# Altium project MB1272.PrjPcb (part 1 of 5)
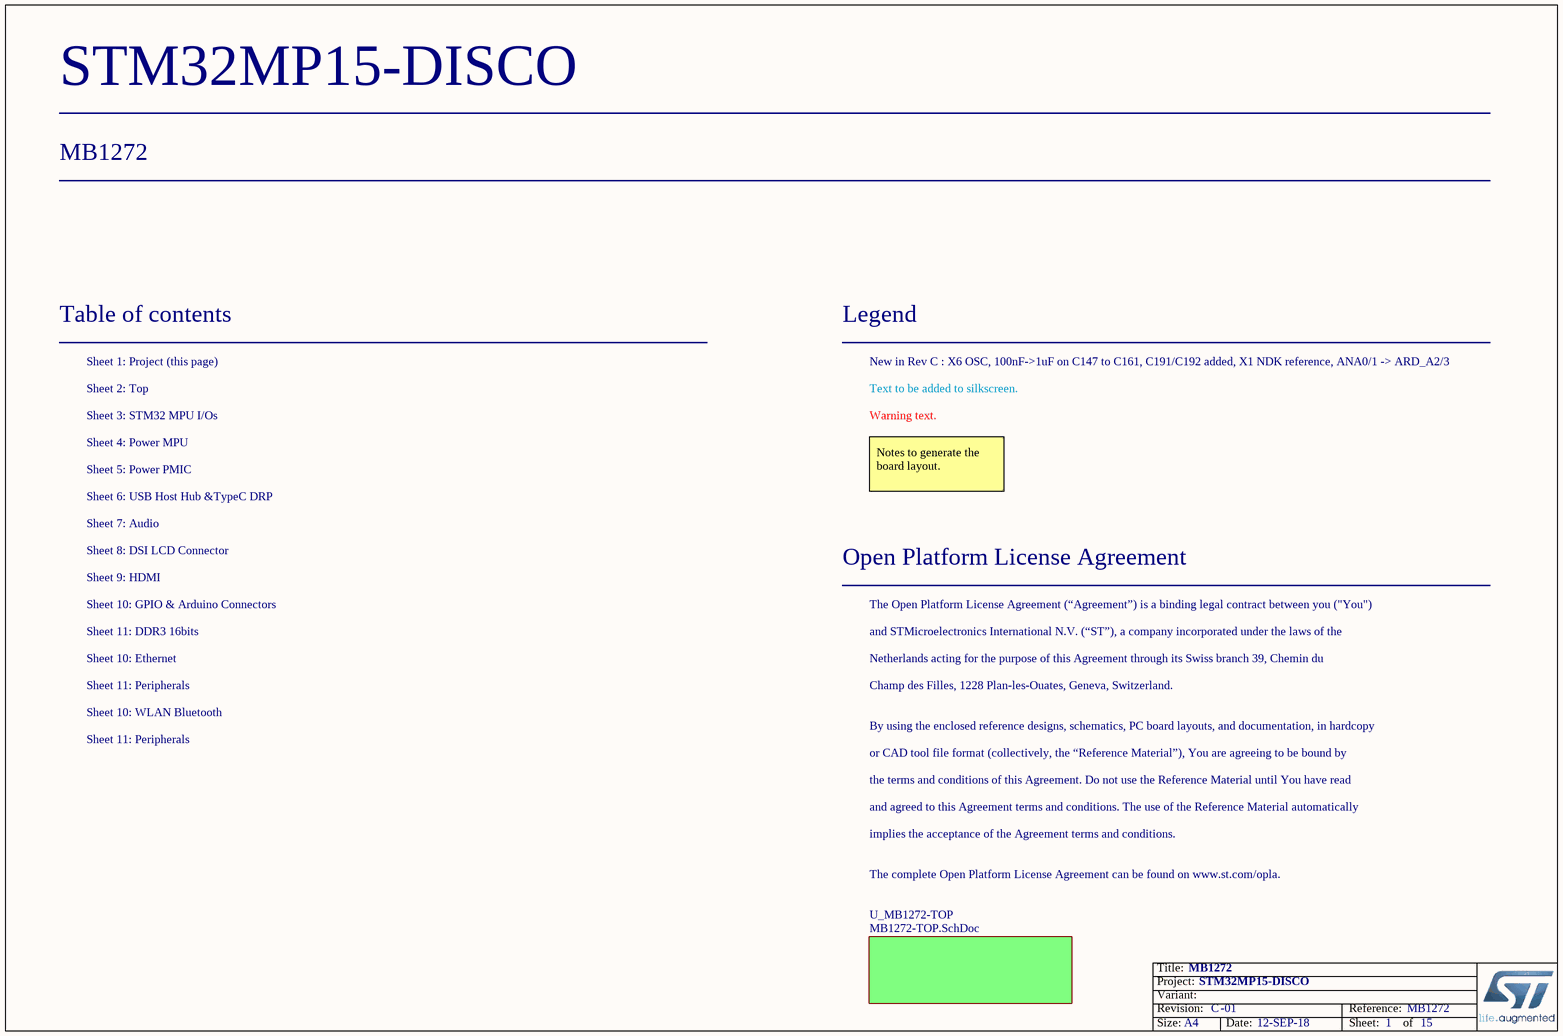
[diagram p0: MB1272-Project.SchDoc]
Board_Assembly_Revision: 01; Board_Document_Date: 12-SEP-18; Board_Name: STM32MP15-DISCO; Board_PCB_Revision: C; Board_Reference: MB1272
15 sheets, 519 parts. Net scope: flat (ports and power ports of the same name join across sheets).
Board file: MB1272C.PcbDoc
Sheets:
  MB1272-Project.SchDoc
    U_MB1272-TOP = MB1272-TOP.SchDoc
      U_Power_PMIC = Power_PMIC.SchDoc
      U_Power_MPU = Power_MPU.SchDoc
      U_MPU_12x12 = MPU_12x12.SchDoc
      U_Peripherals = Peripherals.SchDoc
      U_ST_LINK_V2-1 = ST_LINK_V2-1.SCHDOC
      U_GPIO_&_Arduino_ Connectors = GPIO_&_Arduino_ Connectors.SchDoc
      U_DSI_LCD = DSI_LCD.SchDoc
      U_WLAN_BLUETOOTH = WLAN_BLUETOOTH.SchDoc
      U_Ethernet = Ethernet.SchDoc
      U_HDMI = HDMI.SchDoc
      U_USB_Host_Hub&TypeC_DRP = USB_Host_Hub&TypeC_DRP.SchDoc
      U_AUDIO = AUDIO.SchDoc
      U_DDR3_16bits = DDR3_16bits.SchDoc

## Sheet MB1272-Project.SchDoc: MB1272
size A4; Date: Not used; ApprovedBy: Not used; CheckedBy: Not used; Author: Not used; CompanyName: STMicroelectronics; DrawnBy: Not used; Engineer: Not used; Organization: Not used; Address1: Not used; Address2: Not used; Address3: Not used; Address4: Not used; DocumentNumber: Not used; Revision: Not used; SheetNumber: 1; SheetTotal: 15; CurrentTime: Not used; CurrentDate: Not used; Time: Not used; DocumentFullPathAndName: Not used; DocumentName: Not used; ModifiedDate: Not used; ImagePath: Not used; ProjectName: STM32MP15x-DISCO-PI; Application_BuildNumber: Not used

### Sub-sheets
U_MB1272-TOP = MB1272-TOP.SchDoc: no entries

### Notes on the sheet
- Table of contents
- Sheet 1: Project (this page)
- Legend
- New in Rev C : X6 OSC, 100nF->1uF on C147 to C161, C191/C192 added, X1 NDK reference, ANA0/1 -> ARD_A2/3
- Sheet 2: Top
- Sheet 3: STM32 MPU I/Os
- Sheet 4: Power MPU
- Text to be added to silkscreen.
- Warning text.
- Sheet 6: USB Host Hub &TypeC DRP
- Sheet 5: Power PMIC
- Notes to generate the board layout.
- Sheet 7: Audio
- Sheet 9: HDMI
- Sheet 8: DSI LCD Connector
- Open Platform License Agreement
- Sheet 10: GPIO & Arduino Connectors
- Sheet 11: DDR3 16bits
- The Open Platform License Agreement (“Agreement”) is a binding legal contract between you ("You")
- and STMicroelectronics International N.V. (“ST”), a company incorporated under the laws of the
- Sheet 10: Ethernet
- Sheet 11: Peripherals
- Sheet 10: WLAN Bluetooth
- Netherlands acting for the purpose of this Agreement through its Swiss branch 39, Chemin du
- Champ des Filles, 1228 Plan-les-Ouates, Geneva, Switzerland.
- By using the enclosed reference designs, schematics, PC board layouts, and documentation, in hardcopy
- or CAD tool file format (collectively, the “Reference Material”), You are agreeing to be bound by
- the terms and conditions of this Agreement. Do not use the Reference Material until You have read
- and agreed to this Agreement terms and conditions. The use of the Reference Material automatically
- implies the acceptance of the Agreement terms and conditions.
- The complete Open Platform License Agreement can be found on www.st.com/opla.
- Title:
- Project:
- Size:
- Revision:
- Variant:
- A4
- -
- Date:
- Reference:
- Sheet:
- of

## Sheet MB1272-TOP.SchDoc: MB1272-TOP
size A4; CompanyName: STMicroelectronics; DocumentNumber: MB1272; Revision: B-01; SheetNumber: 2; SheetTotal: 15; Project: STM32MP15-DISCO PI
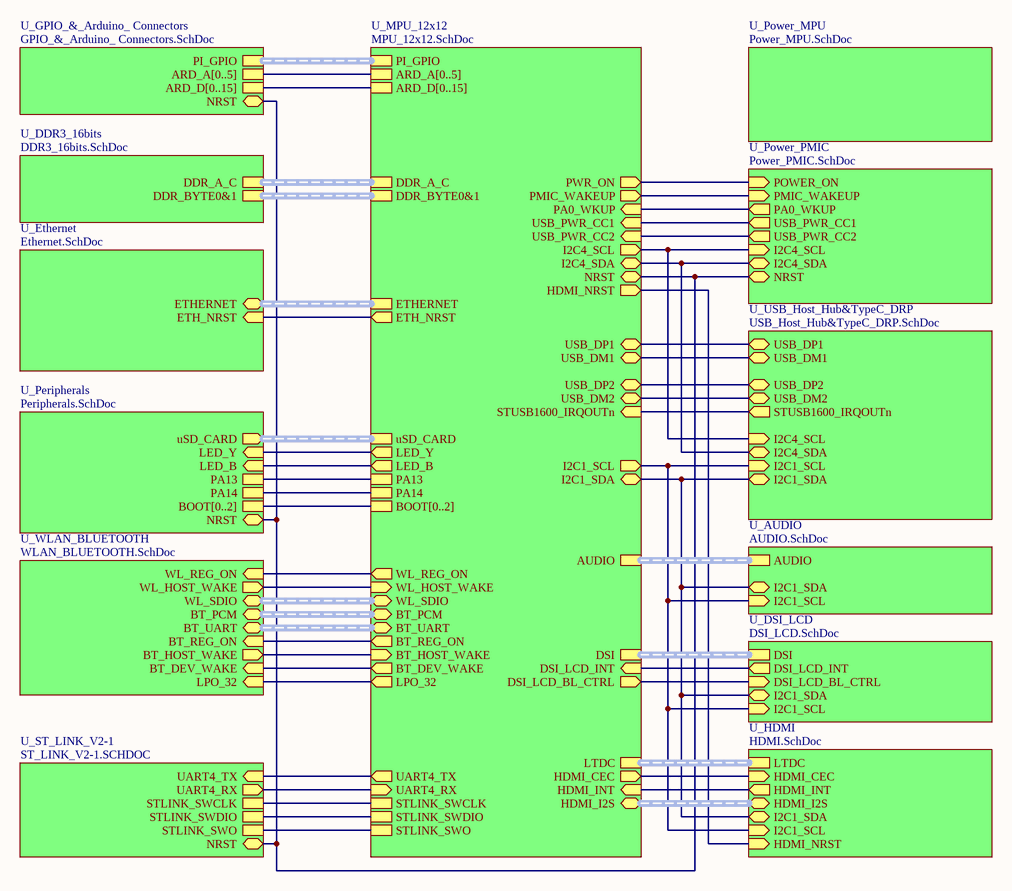
[diagram p1: MB1272-TOP.SchDoc]

### Sub-sheets
U_AUDIO = AUDIO.SchDoc: I2C1_SCL (in), I2C1_SDA (bidir), AUDIO (harness AUDIO)
U_DDR3_16bits = DDR3_16bits.SchDoc: DDR_A_C (harness DDR_A_C), DDR_BYTE0&1 (harness DDR_BYTE_0&1)
U_DSI_LCD = DSI_LCD.SchDoc: DSI (harness DSI), I2C1_SDA (bidir), I2C1_SCL (in), DSI_LCD_BL_CTRL (in), DSI_LCD_INT (out)
U_Ethernet = Ethernet.SchDoc: ETHERNET (harness ETHERNET), ETH_NRST (in)
U_GPIO_&_Arduino_ Connectors = GPIO_&_Arduino_ Connectors.SchDoc: NRST (bidir), ARD_A[0..5], ARD_D[0..15], PI_GPIO (harness PI_GPIO)
U_HDMI = HDMI.SchDoc: LTDC (harness LTDC), HDMI_CEC (in), I2C1_SDA (bidir), HDMI_INT (out), I2C1_SCL (in), HDMI_I2S (harness HDMI_I2S), HDMI_NRST (in)
U_MPU_12x12 = MPU_12x12.SchDoc: DDR_BYTE0&1 (harness DDR_BYTE_0&1), DDR_A_C (harness DDR_A_C), STLINK_SWDIO, STLINK_SWCLK, STLINK_SWO, UART4_TX (out), UART4_RX (in), PA13, PA14, PI_GPIO (harness PI_GPIO), ETHERNET (harness ETHERNET), AUDIO (harness AUDIO), PMIC_WAKEUP (out), PA0_WKUP (in), NRST (bidir), PWR_ON (out), I2C4_SCL (out), I2C4_SDA (bidir), DSI (harness DSI), LTDC (harness LTDC), HDMI_CEC (out), uSD_CARD (harness uSD_CARD), BOOT[0..2], ARD_A[0..5], ARD_D[0..15], I2C1_SDA (bidir), I2C1_SCL (out), USB_DM1 (bidir), USB_DM2 (bidir), USB_DP2 (bidir), USB_DP1 (bidir), DSI_LCD_BL_CTRL (out), DSI_LCD_INT (in), HDMI_INT (in), WL_SDIO (harness WLAN_SDIO), BT_PCM (harness BT_PCM), BT_UART (harness BT_UART), BT_REG_ON (out), BT_HOST_WAKE (in), WL_REG_ON (out), BT_DEV_WAKE (out), WL_HOST_WAKE (in), HDMI_I2S (harness HDMI_I2S), STUSB1600_IRQOUTn (in), LPO_32 (out), USB_PWR_CC1 (in), USB_PWR_CC2 (in), LED_Y (out), LED_B (out), HDMI_NRST (out), ETH_NRST (out)
U_Peripherals = Peripherals.SchDoc: BOOT[0..2], PA13, PA14, NRST (bidir), uSD_CARD (harness uSD_CARD), LED_B (in), LED_Y (in)
U_Power_MPU = Power_MPU.SchDoc: no entries
U_Power_PMIC = Power_PMIC.SchDoc: I2C4_SDA (bidir), I2C4_SCL (in), PA0_WKUP (out), NRST (bidir), POWER_ON (in), PMIC_WAKEUP (in), USB_PWR_CC1 (out), USB_PWR_CC2 (out)
U_ST_LINK_V2-1 = ST_LINK_V2-1.SCHDOC: NRST (bidir), STLINK_SWO, STLINK_SWDIO, STLINK_SWCLK, UART4_RX (out), UART4_TX (in)
U_USB_Host_Hub&TypeC_DRP = USB_Host_Hub&TypeC_DRP.SchDoc: USB_DP1 (bidir), USB_DM1 (bidir), I2C1_SDA (bidir), I2C1_SCL (in), STUSB1600_IRQOUTn (out), I2C4_SCL (in), I2C4_SDA (bidir), USB_DM2 (bidir), USB_DP2 (bidir)
U_WLAN_BLUETOOTH = WLAN_BLUETOOTH.SchDoc: WL_SDIO (harness WLAN_SDIO), BT_UART (harness BT_UART), BT_PCM (harness BT_PCM), BT_REG_ON (in), BT_HOST_WAKE (out), WL_REG_ON (in), BT_DEV_WAKE (in), WL_HOST_WAKE (out), LPO_32 (in)

### Nets
(unnamed): sheet U_Power_PMIC/I2C4_SDA, sheet U_MPU_12x12/I2C4_SDA, sheet U_USB_Host_Hub&TypeC_DRP/I2C4_SDA
(unnamed): sheet U_Power_PMIC/I2C4_SCL, sheet U_MPU_12x12/I2C4_SCL, sheet U_USB_Host_Hub&TypeC_DRP/I2C4_SCL
(unnamed): sheet U_Power_PMIC/PA0_WKUP, sheet U_MPU_12x12/PA0_WKUP
(unnamed): sheet U_Power_PMIC/NRST, sheet U_MPU_12x12/NRST, sheet U_Peripherals/NRST, sheet U_ST_LINK_V2-1/NRST, sheet U_GPIO_&_Arduino_ Connectors/NRST
(unnamed): sheet U_Power_PMIC/POWER_ON, sheet U_MPU_12x12/PWR_ON
(unnamed): sheet U_Power_PMIC/PMIC_WAKEUP, sheet U_MPU_12x12/PMIC_WAKEUP
(unnamed): sheet U_Power_PMIC/USB_PWR_CC1, sheet U_MPU_12x12/USB_PWR_CC1
(unnamed): sheet U_Power_PMIC/USB_PWR_CC2, sheet U_MPU_12x12/USB_PWR_CC2
(unnamed): sheet U_MPU_12x12/STLINK_SWDIO, sheet U_ST_LINK_V2-1/STLINK_SWDIO
(unnamed): sheet U_MPU_12x12/STLINK_SWCLK, sheet U_ST_LINK_V2-1/STLINK_SWCLK
(unnamed): sheet U_MPU_12x12/STLINK_SWO, sheet U_ST_LINK_V2-1/STLINK_SWO
(unnamed): sheet U_MPU_12x12/UART4_TX, sheet U_ST_LINK_V2-1/UART4_TX
(unnamed): sheet U_MPU_12x12/UART4_RX, sheet U_ST_LINK_V2-1/UART4_RX
(unnamed): sheet U_MPU_12x12/PA13, sheet U_Peripherals/PA13
(unnamed): sheet U_MPU_12x12/PA14, sheet U_Peripherals/PA14
(unnamed): sheet U_MPU_12x12/HDMI_CEC, sheet U_HDMI/HDMI_CEC
(unnamed): sheet U_MPU_12x12/I2C1_SDA, sheet U_DSI_LCD/I2C1_SDA, sheet U_HDMI/I2C1_SDA, sheet U_USB_Host_Hub&TypeC_DRP/I2C1_SDA, sheet U_AUDIO/I2C1_SDA
(unnamed): sheet U_MPU_12x12/I2C1_SCL, sheet U_DSI_LCD/I2C1_SCL, sheet U_HDMI/I2C1_SCL, sheet U_USB_Host_Hub&TypeC_DRP/I2C1_SCL, sheet U_AUDIO/I2C1_SCL
(unnamed): sheet U_MPU_12x12/USB_DM1, sheet U_USB_Host_Hub&TypeC_DRP/USB_DM1
(unnamed): sheet U_MPU_12x12/USB_DM2, sheet U_USB_Host_Hub&TypeC_DRP/USB_DM2
(unnamed): sheet U_MPU_12x12/USB_DP2, sheet U_USB_Host_Hub&TypeC_DRP/USB_DP2
(unnamed): sheet U_MPU_12x12/USB_DP1, sheet U_USB_Host_Hub&TypeC_DRP/USB_DP1
(unnamed): sheet U_MPU_12x12/DSI_LCD_BL_CTRL, sheet U_DSI_LCD/DSI_LCD_BL_CTRL
(unnamed): sheet U_MPU_12x12/DSI_LCD_INT, sheet U_DSI_LCD/DSI_LCD_INT
(unnamed): sheet U_MPU_12x12/HDMI_INT, sheet U_HDMI/HDMI_INT
(unnamed): sheet U_MPU_12x12/BT_REG_ON, sheet U_WLAN_BLUETOOTH/BT_REG_ON
(unnamed): sheet U_MPU_12x12/BT_HOST_WAKE, sheet U_WLAN_BLUETOOTH/BT_HOST_WAKE
(unnamed): sheet U_MPU_12x12/WL_REG_ON, sheet U_WLAN_BLUETOOTH/WL_REG_ON
(unnamed): sheet U_MPU_12x12/BT_DEV_WAKE, sheet U_WLAN_BLUETOOTH/BT_DEV_WAKE
(unnamed): sheet U_MPU_12x12/WL_HOST_WAKE, sheet U_WLAN_BLUETOOTH/WL_HOST_WAKE
(unnamed): sheet U_MPU_12x12/STUSB1600_IRQOUTn, sheet U_USB_Host_Hub&TypeC_DRP/STUSB1600_IRQOUTn
(unnamed): sheet U_MPU_12x12/LPO_32, sheet U_WLAN_BLUETOOTH/LPO_32
(unnamed): sheet U_MPU_12x12/LED_Y, sheet U_Peripherals/LED_Y
(unnamed): sheet U_MPU_12x12/LED_B, sheet U_Peripherals/LED_B
(unnamed): sheet U_MPU_12x12/HDMI_NRST, sheet U_HDMI/HDMI_NRST
(unnamed): sheet U_MPU_12x12/ETH_NRST, sheet U_Ethernet/ETH_NRST

### Buses and harness runs
bus sheet U_GPIO_&_Arduino_ Connectors/ARD_A[0..5] = sheet U_MPU_12x12/ARD_A[0..5]
bus sheet U_GPIO_&_Arduino_ Connectors/ARD_D[0..15] = sheet U_MPU_12x12/ARD_D[0..15]
bus sheet U_MPU_12x12/BOOT[0..2] = sheet U_Peripherals/BOOT[0..2]
harness sheet U_AUDIO/AUDIO = sheet U_MPU_12x12/AUDIO
harness sheet U_DDR3_16bits/DDR_A_C = sheet U_MPU_12x12/DDR_A_C
harness sheet U_DDR3_16bits/DDR_BYTE0&1 = sheet U_MPU_12x12/DDR_BYTE0&1
harness sheet U_DSI_LCD/DSI = sheet U_MPU_12x12/DSI
harness sheet U_Ethernet/ETHERNET = sheet U_MPU_12x12/ETHERNET
harness sheet U_GPIO_&_Arduino_ Connectors/PI_GPIO = sheet U_MPU_12x12/PI_GPIO
harness sheet U_HDMI/HDMI_I2S = sheet U_MPU_12x12/HDMI_I2S
harness sheet U_HDMI/LTDC = sheet U_MPU_12x12/LTDC
harness sheet U_MPU_12x12/BT_PCM = sheet U_WLAN_BLUETOOTH/BT_PCM
harness sheet U_MPU_12x12/BT_UART = sheet U_WLAN_BLUETOOTH/BT_UART
harness sheet U_MPU_12x12/uSD_CARD = sheet U_Peripherals/uSD_CARD
harness sheet U_MPU_12x12/WL_SDIO = sheet U_WLAN_BLUETOOTH/WL_SDIO

### Notes on the sheet
- Title:
- Project:
- Size:
- Revision:
- Variant:
- A4
- -
- Date:
- Reference:
- Sheet:
- of

## Sheet Power_PMIC.SchDoc: Power_PMIC
size A3; Date: 01-DEC-2013; CompanyName: STMicroelectronics; Organization: Microcontrollers Division; Address1: 12, Rue Jules HOROWITZ; Address2: 38019 Grenoble; Address3: FRANCE; DocumentNumber: MB1272; Revision: A-01; SheetNumber: 5; SheetTotal: 15; Project: STM32MP15-DISCO PI
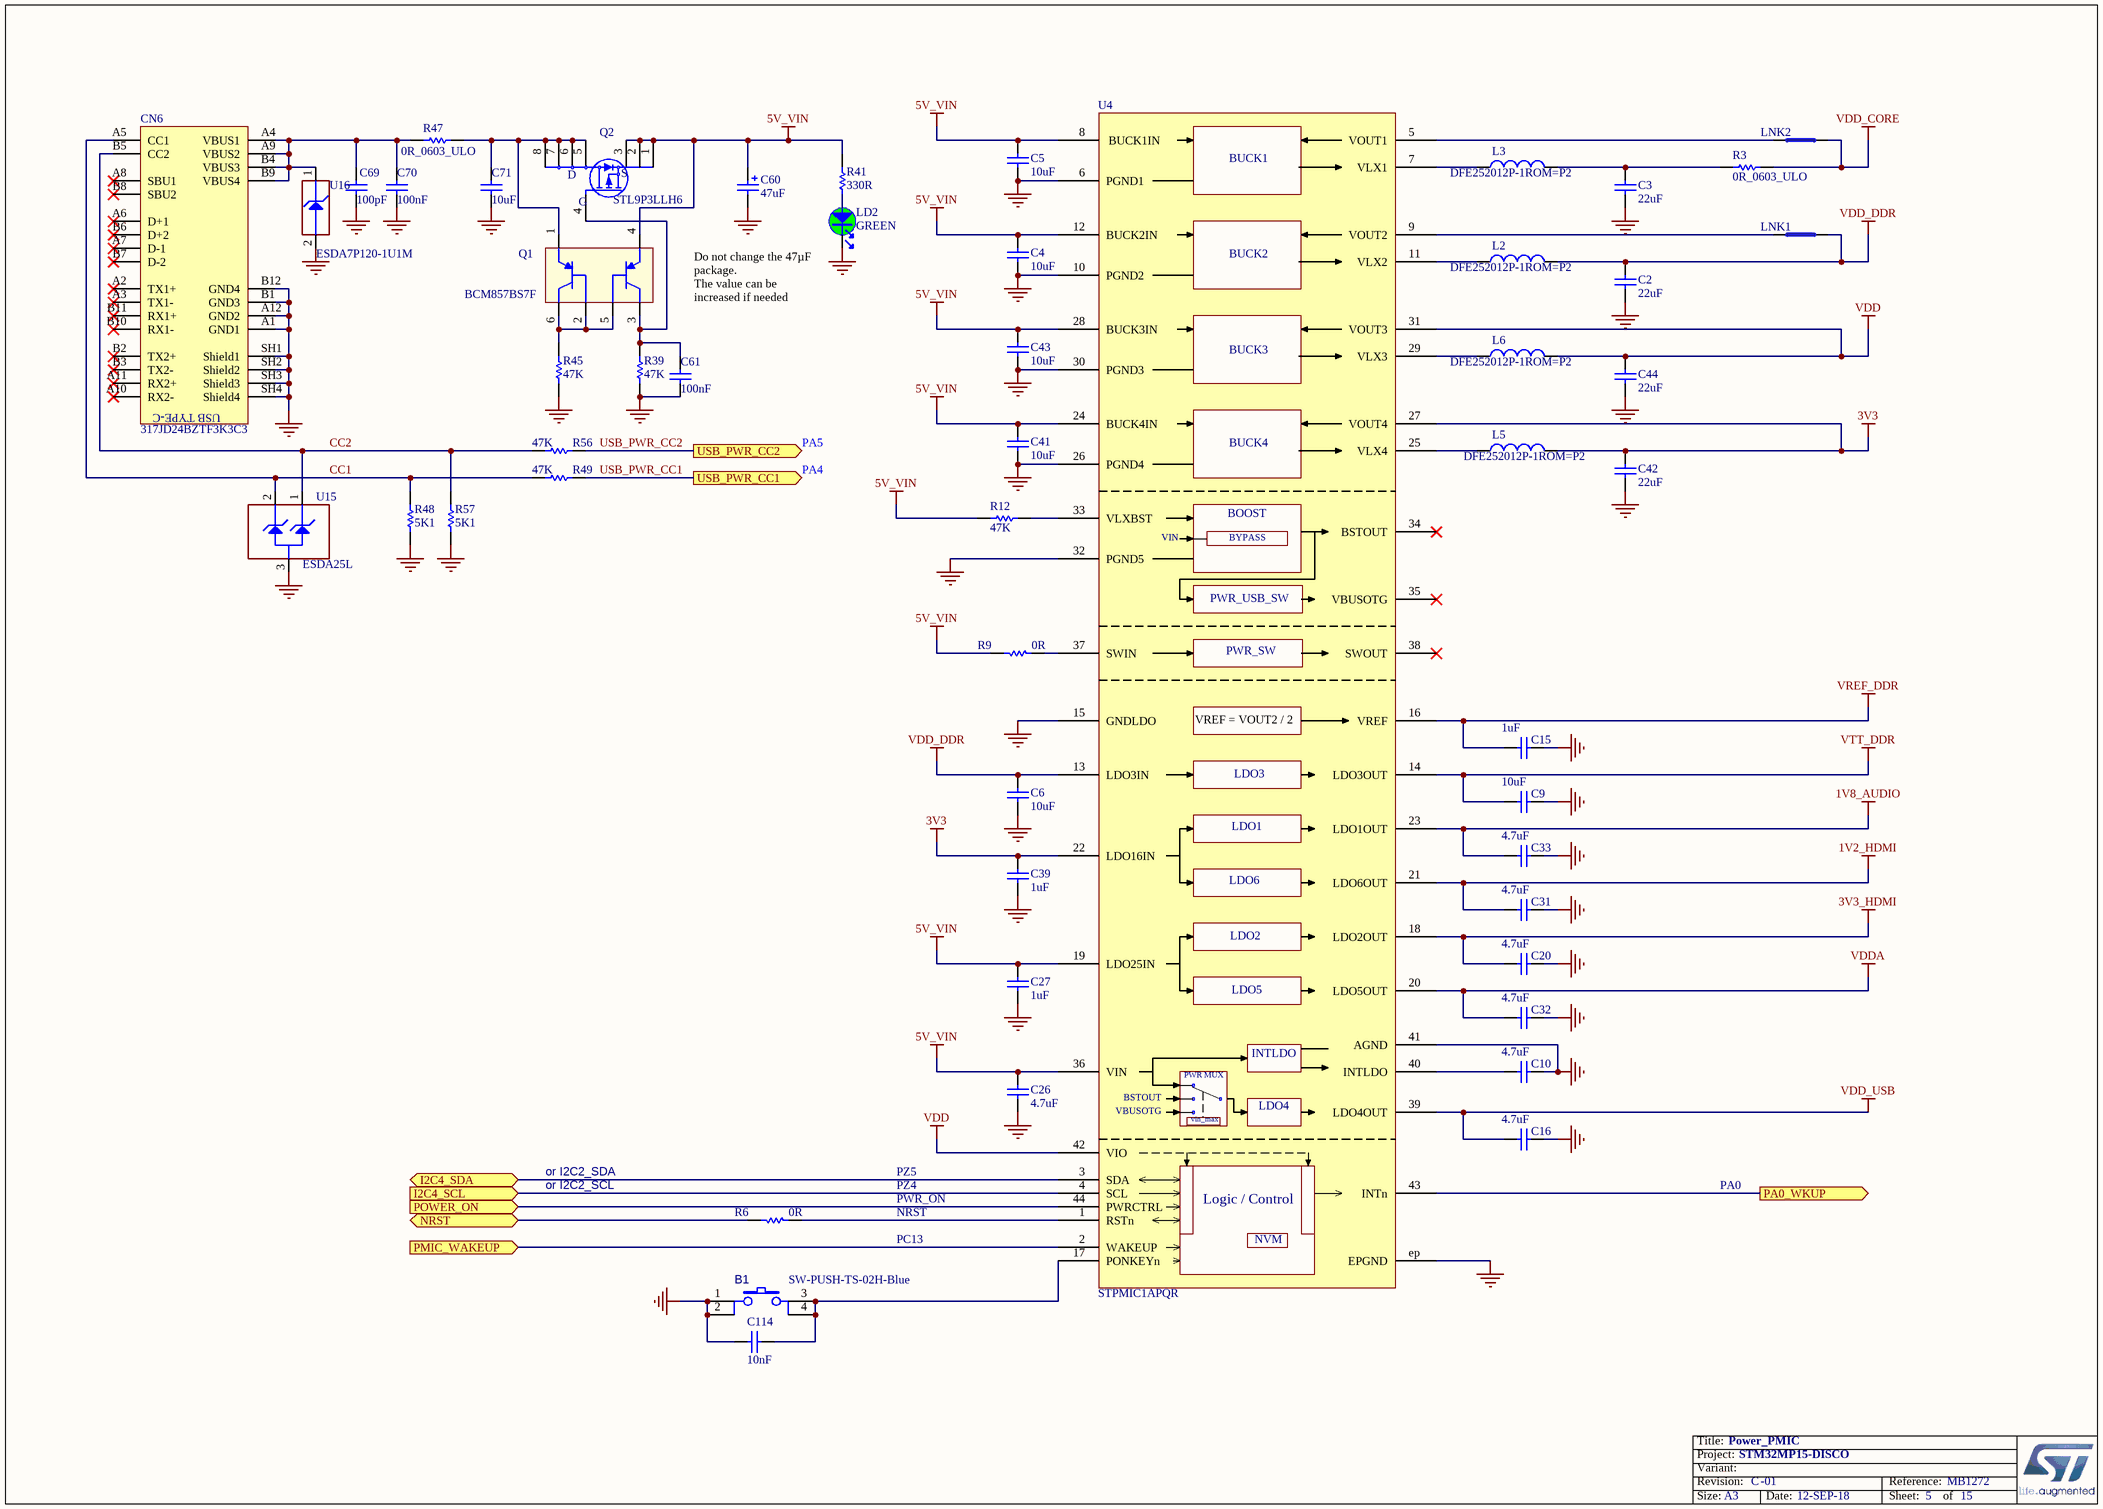
[diagram p2: Power_PMIC.SchDoc]

### Parts
B1  value SW-PUSH-TS-02H-Blue  [SWI_JIUBABA_C-TS-02H-2-5-B-V-T_R_BLUE]
C2  value 22uF  [C0603]
C3  value 22uF  [C0603]
C4  value 10uF  [C0603]
C5  value 10uF  [C0603]
C6  value 10uF  [C0603]
C9  value 10uF  [C0603]
C10  value 4.7uF  [C0402]  (hidden comment: Capacitor)
C15  value 1uF  [C0402]
C16  value 4.7uF  [C0402]  (hidden comment: Capacitor)
C20  value 4.7uF  [C0402]  (hidden comment: Capacitor)
C26  value 4.7uF  [C0402]  (hidden comment: Capacitor)
C27  value 1uF  [C0402]
C31  value 4.7uF  [C0402]  (hidden comment: Capacitor)
C32  value 4.7uF  [C0402]  (hidden comment: Capacitor)
C33  value 4.7uF  [C0402]  (hidden comment: Capacitor)
C39  value 1uF  [C0402]
C41  value 10uF  [C0603]
C42  value 22uF  [C0603]
C43  value 10uF  [C0603]
C44  value 22uF  [C0603]
C60  value 47uF  [CPOL_TAJ-C_2312_H2P6]  (hidden comment: Cap_POL_TANA)
C61  value 100nF  [C0402]
C69  value 100pF  [C0402]  (hidden comment: Capacitor)
C70  value 100nF  [C0402]
C71  value 10uF  [C0805]  (hidden comment: Capacitor)
C114  value 10nF  [C0402]
CN6  value 317JD24BZTF3K3C3  [CON_USB-TYPEC_COXOC_317JD24BZTF3K3C3]
L2  Manufacturer_Part_Number: DFE252012P-1ROM=P2  [IND_2520_TOKO_DFE252012P]  (hidden comment: IND_1uH_42mohm_3.2A)
L3  Manufacturer_Part_Number: DFE252012P-1ROM=P2  [IND_2520_TOKO_DFE252012P]  (hidden comment: IND_1uH_42mohm_3.2A)
L5  Manufacturer_Part_Number: DFE252012P-1ROM=P2  [IND_2520_TOKO_DFE252012P]  (hidden comment: IND_1uH_42mohm_3.2A)
L6  Manufacturer_Part_Number: DFE252012P-1ROM=P2  [IND_2520_TOKO_DFE252012P]  (hidden comment: IND_1uH_42mohm_3.2A)
LD2  value GREEN  [LED_0603_GREEN]
LNK1  link_200  [LINK200]  (value not drawn)  (no BOM)
LNK2  link_200  [LINK200]  (value not drawn)  (no BOM)
Q1  value BCM857BS7F  [DIO_SOT363]
Q2  value STL9P3LLH6  [MOS_POWERFLAT_3P3X3P3_P065]
R3  value 0R_0603_ULO  [R0603]
R6  value 0R  [R0402]
R9  value 0R  [R0402]
R12  value 47K  [R0402]  (hidden comment: Resistor)
R39  value 47K  [R0402]  (hidden comment: Resistor)
R41  value 330R  [R0402]
R45  value 47K  [R0402]  (hidden comment: Resistor)
R47  value 0R_0603_ULO  [R0603]
R48  value 5K1  [R0402]  (hidden comment: Resistor)
R49  value 47K  [R0402]  (hidden comment: Resistor)
R56  value 47K  [R0402]  (hidden comment: Resistor)
R57  value 5K1  [R0402]  (hidden comment: Resistor)
U4  value STPMIC1APQR  [ICC_WFQFN44-EPAD_5X6_P040]  (hidden comment: STPMU1)
U15  value ESDA25L  [ESD_SOT23]  (hidden comment: New schematic symbol : correction 2 diodes instead of one)
U16  value ESDA7P120-1U1M  [ESD_QFN1610_2N_1K_2A]  (hidden comment: ​Footprint needed DFN105P160X60-2N)

### Ports
I2C4_SCL (in), I2C4_SDA (bidir), NRST (bidir), PA0_WKUP (out), PMIC_WAKEUP (in), POWER_ON (in), USB_PWR_CC1 (out), USB_PWR_CC2 (out)

### Nets
1V2_HDMI: C31.2 U4.21(LDO6OUT)
1V8_AUDIO: C33.2 U4.23(LDO1OUT)
3V3: C39.2 C42.2 L5.2 U4.22(LDO16IN) U4.27(VOUT4)
3V3_HDMI: C20.2 U4.18(LDO2OUT)
5V_VIN: C4.2 C5.2 C26.2 C27.2 C41.2 C43.2 C60.1 Q1.4(E2) Q2.1(S) Q2.2(S) Q2.3(S) R9.1 R12.2 R41.2 U4.8(BUCK1IN) U4.12(BUCK2IN) U4.19(LDO25IN) U4.24(BUCK4IN) U4.28(BUCK3IN) U4.36(VIN)
GND: B1.1 B1.2 C2.1 C3.1 C4.1 C5.1 C6.1 C9.1 C10.2 C15.1 C16.1 C20.1 C26.1 C27.1 C31.1 C32.1 C33.1 C39.1 C41.1 C42.1 C43.1 C44.1 C60.2 C61.2 C69.1 C70.2 C71.1 C114.1 CN6.A1(GND1) CN6.A12(GND2) CN6.B1(GND3) CN6.B12(GND4) CN6.SH1(Shield1) CN6.SH2(Shield2) CN6.SH3(Shield3) CN6.SH4(Shield4) LD2.2 R39.1 R45.1 R48.1 R57.1 U4.6(PGND1) U4.10(PGND2) U4.15(GNDLDO) U4.26(PGND4) U4.30(PGND3) U4.32(PGND5) U4.41(AGND) U4.ep(EPGND) U15.3(GND) U16.2(GND)
VDD: C44.2 L6.2 U4.31(VOUT3) U4.42(VIO)
VDD_CORE: LNK2.2 R3.2
VDD_DDR: C2.2 C6.2 L2.2 LNK1.2 U4.13(LDO3IN)
VDD_USB: C16.2 U4.39(LDO4OUT)
VDDA: C32.2 U4.20(LDO5OUT)
VREF_DDR: C15.2 U4.16(VREF)
VTT_DDR: C9.2 U4.14(LDO3OUT)
CC1: CN6.A5(CC1) R48.2 R49.1 U15.2(IO2)
CC2: CN6.B5(CC2) R56.1 R57.2 U15.1(IO1)
I2C4_SCL: U4.4(SCL) ; port I2C4_SCL
I2C4_SDA: U4.3(SDA) ; port I2C4_SDA
NRST: R6.1 ; port NRST
PA0_WKUP: U4.43(INTn) ; port PA0_WKUP
PMIC_WAKEUP: U4.2(WAKEUP) ; port PMIC_WAKEUP
USB_PWR_CC1: R49.2 ; port USB_PWR_CC1
USB_PWR_CC2: R56.2 ; port USB_PWR_CC2
NetB1_3: B1.3 B1.4 C114.2 U4.17(PONKEYn)
NetC3_2: C3.2 L3.2 R3.1
NetC10_1: C10.1 U4.40(INTLDO)
NetC61_1: C61.1 Q1.3(C2) Q2.4(G) R39.2
NetC69_2: C69.2 C70.1 CN6.A4(VBUS1) CN6.A9(VBUS2) CN6.B4(VBUS3) CN6.B9(VBUS4) R47.1 U16.1(IO1)
NetC71_2: C71.2 Q1.1(E1) Q2.5(D) Q2.6(D) Q2.7(D) Q2.8(D) R47.2
NetL2_1: L2.1 U4.11(VLX2)
NetL3_1: L3.1 U4.7(VLX1)
NetL5_1: L5.1 U4.25(VLX4)
NetL6_1: L6.1 U4.29(VLX3)
NetLD2_1: LD2.1 R41.1
NetLNK1_1: LNK1.1 U4.9(VOUT2)
NetLNK2_1: LNK2.1 U4.5(VOUT1)
NetQ1_2: Q1.2(B1) Q1.5(B2) Q1.6(C1) R45.2
NetR6_2: R6.2 U4.1(RSTn)
NetR9_2: R9.2 U4.37(SWIN)
NetR12_1: R12.1 U4.33(VLXBST)
NetU4_44: U4.44(PWRCTRL) ; port POWER_ON

Not connected (* = marked no-connect by the designer): CN6 A2(TX1+)* A3(TX1-)* A6(D+1)* A7(D-1)* A8(SBU1)* A10(RX2-)* A11(RX2+)* B2(TX2+)* B3(TX2-)* B6(D+2)* B7(D-2)* B8(SBU2)* B10(RX1-)* B11(RX1+)*; U4 34(BSTOUT)* 35(VBUSOTG)* 38(SWOUT)*

### Notes on the sheet
- (near LD2) Do not change the 47µF package.
  The value can be increased if needed
- PA5
- PA4
- or I2C2_SDA
- or I2C2_SCL
- PZ5
- PZ4
- PA0
- NRST
- PWR_ON
- PC13
- Title:
- Project:
- Size:
- Revision:
- Variant:
- A3
- -
- Date:
- Reference:
- Sheet:
- of
- (in symbol MCD-01108) USB TYPE-C
- (in symbol MCD-01650) BUCK1; BUCK2; BUCK3; BUCK4; BOOST; BYPASS; PWR_USB_SW; PWR_SW; VREF = VOUT2 / 2; LDO3; LDO1; LDO6; LDO2; LDO5; PWR MUX; LDO4; vin_max; Logic / Control; NVM

### Library data of the parts
B1 = MCD-00172: Switch HW SMD blue; Part_Type: Misc; Manufacturer_Part_Number: C-TS-02H-2.5-B-V-T/R BLUE; Manufacturer: JIUBABA; Provided_By: SUBCO; Initial_Board_Reference: MB1264; Internal_Part_Number: MCD-00172; Status: Checked; ComponentLink1Description: Datasheet; ComponentLink1URL: http://tunmcdsvn.tun.st.com/Component_Datasheet_Library/Trunk/Misc/Jiubaba_TS-02H-H2-5
C2 C3 C42 C44 = MCD-00100: Capacitor, MLCC, 22uF, 6V3, X5R, 20%, 0603, T=0,8mm; Manufacturer_Part_Number: GRM188R60J226MEA0J; Manufacturer: MURATA; ECCN_US: EAR99; ECCN_EU: NEC; Provided_By: SUBCO; Initial_Board_Reference: mb1262; Internal_Part_Number: MCD-00100; Status: Released; Part_Type: Capacitor; Package: C0603; ComponentLink1Description: Datasheet; ComponentLink1URL: http://tunmcdsvn.tun.st.com/Component_Datasheet_Library/Trunk/Capacitors/Murata_Capacitor_GR_series
C4-C6 C9 C41 C43 = MCD-00099: Capacitor, MLCC, 10uF, 10V, X5R, 10%, 0603, T=0,8mm; Manufacturer_Part_Number: GRM188R61A106KE69D; Manufacturer: MURATA; ECCN_US: EAR99; ECCN_EU: NEC; Provided_By: SUBCO; Initial_Board_Reference: mb1262; Internal_Part_Number: MCD-00099; Status: Released; Part_Type: Capacitor; Package: C0603; ComponentLink1Description: Datasheet; ComponentLink1URL: http://tunmcdsvn.tun.st.com/Component_Datasheet_Library/Trunk/Capacitors/Murata_Capacitor_GR_series
C10 C16 C20 C26 C31-C33 = MCD-01356: Capacitor, MLCC, 4.7uF, 6V3, X5R, 20%, 0402, T=0,5mm; Manufacturer_Part_Number: GRM155R60J475ME47; Manufacturer: MURATA; Provided_By: SUBCO; Internal_Part_Number: MCD-01356; Status: Released; Part_Type: Capacitor; Package: C0402; ComponentLink1Description: Datasheet; ComponentLink1URL: http://tunmcdsvn.tun.st.com/Component_Datasheet_Library/Trunk/Capacitors/Murata_Capacitor_GR_series
C15 C27 C39 = MCD-00095: Capacitor, MLCC, 1uF, 6V3, X5R, 10%, 0402, T=0,5mm; Manufacturer_Part_Number: GRM155R61E105KA12; Manufacturer: MURATA; Alternate_Manufacturer_Part_Number: GRM155R60J105KE19; ECCN_US: EAR99; ECCN_EU: NEC; Provided_By: SUBCO; Initial_Board_Reference: mb1262; Internal_Part_Number: MCD-00095; Status: Released; Part_Type: Capacitor; Package: C0402; ComponentLink1Description: Datasheet; ComponentLink1URL: http://tunmcdsvn.tun.st.com/Component_Datasheet_Library/Trunk/Capacitors/Murata_Capacitor_GR_series; Alternate_Manufacturer: MURATA
C60 = MCD-00559: Capacitor, Tantalum, 47uF, 16V, 10%, TypeC; Manufacturer_Part_Number: TAJC476K016RNJ; Manufacturer: AVX; Provided_By: SUBCO; Initial_Board_Reference: MB1331; Revision: July-2002: Re-released for DXP Platform.; Internal_Part_Number: MCD-00559; Status: Footprint available; Part_Type: Capacitor; Package: C2312; ComponentLink1Description: Datasheet; ComponentLink1URL: http://tunmcdsvn.tun.st.com/Component_Datasheet_Library/Trunk/Capacitors/AVX_Capacitor_TAJ-series; ECCN_US: n/a; ECCN_EU: n/a
C61 C70 = MCD-00006: Capacitor,100nF,16V,X7R,10%,0402; Manufacturer_Part_Number: CC0402KRX7R7BB104; Manufacturer: YAGEO; Alternate_Manufacturer: MURATA; Alternate_Manufacturer_Part_Number: GCM155R71C104KA55D; Provided_By: SUBCO; Initial_Board_Reference: mb1274; Internal_Part_Number: MCD-00006; ComponentLink1Description: Datasheet; ECCN_US: n/a; ECCN_EU: n/a; Status: Released; Part_Type: Capacitor; Package: C0402; ComponentLink1URL: http://tunmcdsvn.tun.st.com/Component_Datasheet_Library/Trunk/Capacitors/Yageo_Multilayer_Capacitor_X7R_series_100pF_to_22uF
C69 = MCD-00205: Capacitor, MLCC, 100pF, 50V, NPO, 5%, 0402, T=0,5mm; Manufacturer_Part_Number: CC0402JRNPO9BN101; Manufacturer: YAGEO; Provided_By: SUBCO; Internal_Part_Number: MCD-00205; Status: Released; Part_Type: Capacitor; Package: C0402; ComponentLink1Description: Datasheet; ComponentLink1URL: http://tunmcdsvn.tun.st.com/Component_Datasheet_Library/Trunk/Capacitors/Yageo_Capacitor_NP0_16V-to-50V
C71 = MCD-00014: Capacitor, MLCC, 10uF, 25V, X5R, 10%, 0805, T=0,85mm; Manufacturer_Part_Number: CC0805KRX5R8BB106; Manufacturer: YAGEO; Provided_By: SUBCO; Initial_Board_Reference: MB1274; Internal_Part_Number: MCD-00014; Status: Released; Part_Type: Capacitor; Package: C0805; ComponentLink1Description: Datasheet; ComponentLink1URL: http://tunmcdsvn.tun.st.com/Component_Datasheet_Library/Trunk/Capacitors/Yageo_Multilayer_capacitor_X5R_series_100pF_to_100uF; ECCN_US: n/a; ECCN_EU: n/a
C114 = MCD-00011: Capacitor, MLCC, 10nF, 16V, X7R, 10%, 0402, T=0.5mm; Manufacturer_Part_Number: CC0402KRX7R7BB103; Manufacturer: YAGEO; Provided_By: SUBCO; Initial_Board_Reference: mb1274; Internal_Part_Number: MCD-00011; Status: Released; Part_Type: Capacitor; Package: C0402; ComponentLink1Description: Datasheet; ComponentLink1URL: http://tunmcdsvn.tun.st.com/Component_Datasheet_Library/Trunk/Capacitors/Yageo_Multilayer_Capacitor_X7R_series_100pF_to_22uF; ECCN_US: n/a; ECCN_EU: n/a
CN6 = MCD-01108: USB tyce C certified receptacle for 1.6mm pcb height; Part_Type: Connector; Manufacturer: CHANT SINCERE (COXOC); ECCN_US: NA; Provided_By: SUBCO; Initial_Board_Reference: MB1272; Internal_Part_Number: MCD-01108; Status: Released; Manufacturer_Part_Number: 317JD24BZTF3K3C3; ComponentLink1Description: Datasheet; ComponentLink1URL: http://tunmcdsvn.tun.st.com/Component_Datasheet_Library/Trunk/Connectors/Chant%20sincere_usb%20type%20C%20connector%20317JD24BZTF3K3C3; ECCN_EU: NA
L2 L3 L5 L6 = MCD-01122: Power Inductor ,1µH,4.3A max,+-20%,0.042ohm,2520; Manufacturer: MURATA; ECCN_US: EAR99; Provided_By: SUBCO; Initial_Board_Reference: MB1272; Value: 1µH; Internal_Part_Number: MCD-01122; Status: Footprint available; Part_Type: Inductor; Package: 2520; ComponentLink1Description: Datasheet; ComponentLink1URL: http://tunmcdsvn.tun.st.com/Component_Datasheet_Library/Trunk/Inductors/Murata_Power_inductors_DFE252012P-1ROM=P2/Murata_Power_inductors_dfe252012p.pdf; ECCN_EU: EAR99
LD2 = MCD-00050: LED, Green, 0603; Part_Type: Display; Manufacturer_Part_Number: 19-213SYGC/S530-E2/TR8; Manufacturer: EVERLIGHT; ECCN_US: EAR99; ECCN_EU: NEC; Provided_By: SUBCO; Initial_Board_Reference: mb1274; Internal_Part_Number: MCD-00050; Status: Released; ComponentLink1Description: Datasheet; ComponentLink1URL: http://tunmcdsvn.tun.st.com/Component_Datasheet_Library/Trunk/Display/Everlight_SMD-LED-GREEN_19-213SYGC-S530-XX-TR8-v3.doc; Package: LED 0603
LNK1 LNK2 = link_200: link 0.2mm; Value: link_200
Q1 = MCD-01120: Transistor 45V Matched Pair PNP small Signal transistor in SOT363; Part_Type: IC; Manufacturer: DIODES_INC; Alternate_Manufacturer_Part_Number: NST45010MW6T1G; Alternate_Manufacturer: ONSEMI; Provided_By: SUBCO; Initial_Board_Reference: MB1272; Internal_Part_Number: MCD-01120; Status: Checked; Manufacturer_Part_Number: BCM857BS7F; Package: SOT363; ComponentLink1Description: Datasheet; ComponentLink1URL: http://tunmcdsvn.tun.st.com/Component_Datasheet_Library/Trunk/IC/DIODES_INC_Dual_PNP_Transistors_BCM857BS7F/DIODES_INC_Dual_PNP_Transistors_BCM857BS7F.pdf
Q2 = MCD-01126: Power Mosfet, P-channel,VDS -30V,RDS 12mohm typ,ID -9A; Part_Type: IC; Manufacturer: STMICROELECTRONICS; ECCN_US: EAR99; ECCN_EU: NEC; Provided_By: SUBCO with ST control; Initial_Board_Reference: MB1272; Internal_Part_Number: MCD-01126; Status: Checked; Manufacturer_Part_Number: STL9P3LLH6; Package: PowerFLAT 3.3x3.3; ComponentLink1Description: Datasheet; ComponentLink1URL: http://tunmcdsvn.tun.st.com/Component_Datasheet_Library/Trunk/IC/STM_POWER_MOSFET_P_STL9P3LLH6
R3 R47 = MCD-00181: Resistor,0R,0603,ULO; Manufacturer_Part_Number: PMR03EZPJ000; Manufacturer: ROHM; Provided_By: SUBCO; Internal_Part_Number: MCD-00181; Status: Released; Part_Type: Resistor; Package: R0603; ComponentLink1Description: Datasheet; ComponentLink1URL: http://tunmcdsvn.tun.st.com/Component_Datasheet_Library/Trunk/Resistors/ROHM_ULtra_low_Ohmic_Resistor_PMR10EZPJ000; ECCN_US: n/a; ECCN_EU: n/a
R6 R9 = MCD-00052: Resistor,0R,0402,5%,1/16W; Manufacturer_Part_Number: RC0402JR-070RL; Manufacturer: YAGEO; Provided_By: SUBCO; Initial_Board_Reference: mb1274; Internal_Part_Number: MCD-00052; Status: Released; Part_Type: Resistor; Package: R0402; ComponentLink1Description: Datasheet; ComponentLink1URL: http://tunmcdsvn.tun.st.com/Component_Datasheet_Library/Trunk/Resistors/Yageo_Resistor_RC0402-series; ECCN_US: n/a; ECCN_EU: n/a
R12 R39 R45 R49 R56 = MCD-00063: Resistor,47K,0402,1%,1/16W; Manufacturer_Part_Number: RC0402FR-0747KL; Manufacturer: YAGEO; Provided_By: SUBCO; Initial_Board_Reference: MB1274; Internal_Part_Number: MCD-00063; Status: Released; Part_Type: Resistor; Package: R0402; ComponentLink1Description: Datasheet; ComponentLink1URL: http://tunmcdsvn.tun.st.com/Component_Datasheet_Library/Trunk/Resistors/Yageo_Resistor_RC0402-series; ECCN_US: n/a; ECCN_EU: n/a
R41 = MCD-00062: Resistor,330R,0402,1%,1/16W; Manufacturer_Part_Number: RC0402FR-07330RL; Manufacturer: YAGEO; Provided_By: SUBCO; Initial_Board_Reference: mb1274; Internal_Part_Number: MCD-00062; Status: Released; Part_Type: Resistor; Package: R0402; ComponentLink1Description: Datasheet; ComponentLink1URL: http://tunmcdsvn.tun.st.com/Component_Datasheet_Library/Trunk/Resistors/Yageo_Resistor_RC0402-series; ECCN_US: n/a; ECCN_EU: n/a
R48 R57 = MCD-00333: Resistor,5K1,0402,1%,1/16W; Manufacturer_Part_Number: RC0402FR-075K1L; Manufacturer: YAGEO; Provided_By: SUBCO; Initial_Board_Reference: MB1272; Internal_Part_Number: MCD-00333; Status: Released; Part_Type: Resistor; Package: R0402; ComponentLink1Description: Datasheet; ComponentLink1URL: http://tunmcdsvn.tun.st.com/Component_Datasheet_Library/Trunk/Resistors/Yageo_Resistor_RC0402-series; ECCN_US: n/a; ECCN_EU: n/a
U4 = MCD-01650: ST PMIC:  4 step-down + 1 advanced boost SMPS, 6 LDOs, 2 pwr switches, DDR Vref, NVM option 'A' for IO@3.3V; Part_Type: IC; Manufacturer: STMICROELECTRONICS; Provided_By: SUBCO with ST control; Internal_Part_Number: MCD-01650; Status: Footprint available; Manufacturer_Part_Number: STPMIC1APQR; Package: WFQFN 5.0x6.0x0.80mm; ComponentLink1Description: Datasheet; ComponentLink1URL: http://tunmcdsvn.tun.st.com/Component_Datasheet_Library/Trunk/IC/STM_PMIC_LuftBurg_5x6_44L_20_01_2016
U15 = MCD-01125: DUAL TRANSIL ARRAY FOR ESD PROTECTION; Part_Type: Diode; Manufacturer: STMICROELECTRONICS; BMS_Part_Number: 9151131; ECCN_US: EAR99; ECCN_EU: NEC; Provided_By: SUBCO with ST control; Initial_Board_Reference: MB1272; Internal_Part_Number: MCD-01125; Status: Checked; Manufacturer_Part_Number: ESDA25L; Package: ESD_SOT23; ComponentLink1Description: Datasheet; ComponentLink1URL: http://tunmcdsvn.tun.st.com/Component_Datasheet_Library/Trunk/Diodes/STM_ESD_ESDA25L
U16 = MCD-01026: High power transient voltage suppressor; Part_Type: Diode; Manufacturer: STMICROELECTRONICS; BMS_Part_Number: 9179046; ECCN_US: EAR99; ECCN_EU: NEC; Provided_By: SUBCO with ST control; Initial_Board_Reference: MB1378; Internal_Part_Number: MCD-01026; Status: Released; Manufacturer_Part_Number: ESDA7P120-1U1M; Package: QFN1610; ComponentLink1Description: Datasheet; ComponentLink1URL: http://tunmcdsvn.tun.st.com/Component_Datasheet_Library/Trunk/Diodes/STM_ESD_ESDA7P120-1U1M

## Sheet Power_MPU.SchDoc: Power_MPU
size A3; CompanyName: STMicroelectronics; DocumentNumber: MB1272; Revision: A-01; SheetNumber: 4; SheetTotal: 15; Project: STM32MP15-DISCO PI
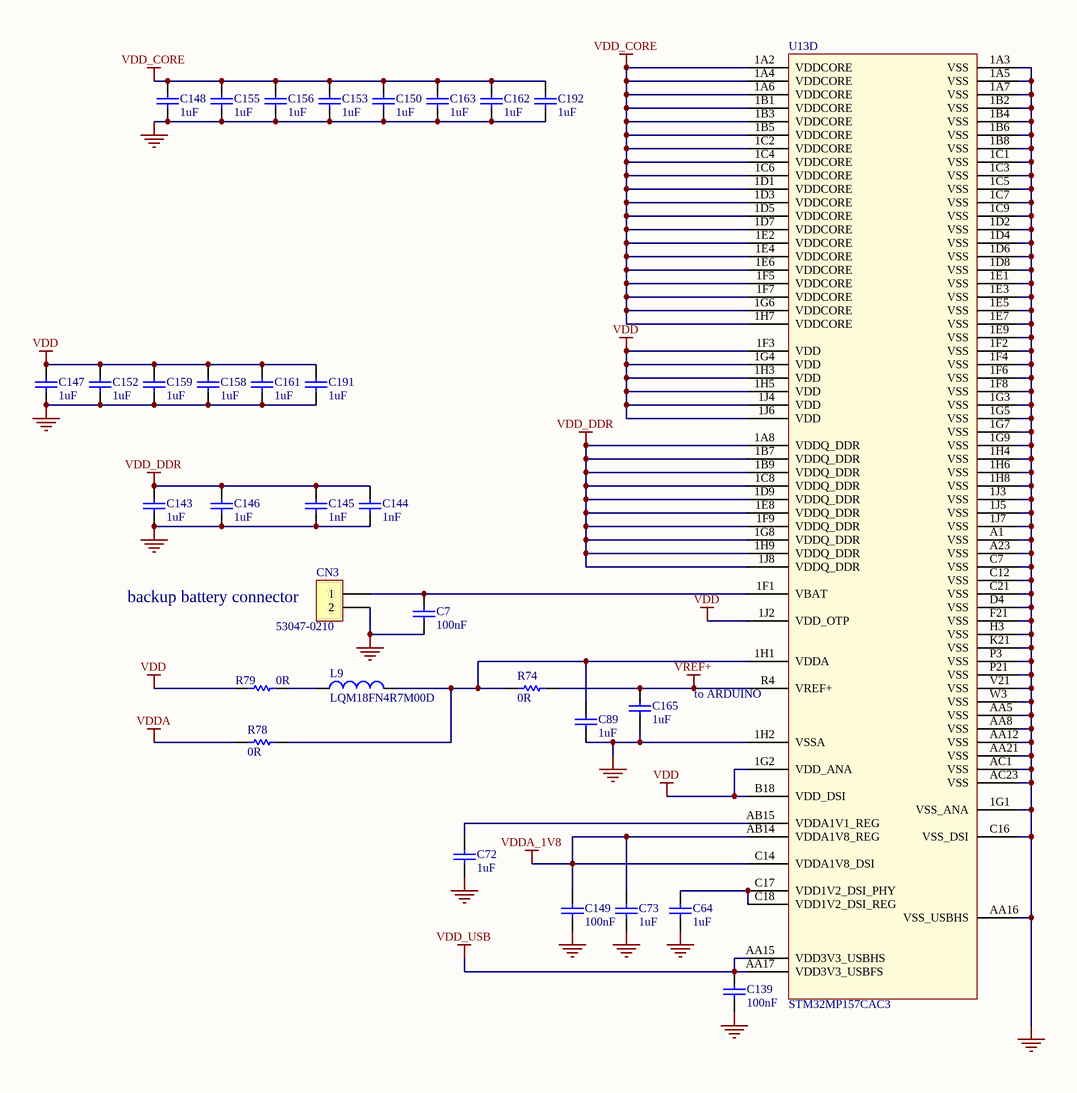
[diagram p3: Power_MPU.SchDoc]

### Parts
C7  value 100nF  [C0402]
C64  value 1uF  [C0402]
C72  value 1uF  [C0402]
C73  value 1uF  [C0402]
C89  value 1uF  [C0402]
C139  value 100nF  [C0402]
C143  value 1uF  [C0402]
C144  value 1nF  [C0402]
C145  value 1nF  [C0402]
C146  value 1uF  [C0402]
C147  value 1uF  [C0402]
C148  value 1uF  [C0402]
C149  value 100nF  [C0402]
C150  value 1uF  [C0402]
C152  value 1uF  [C0402]
C153  value 1uF  [C0402]
C155  value 1uF  [C0402]
C156  value 1uF  [C0402]
C158  value 1uF  [C0402]
C159  value 1uF  [C0402]
C161  value 1uF  [C0402]
C162  value 1uF  [C0402]
C163  value 1uF  [C0402]
C165  value 1uF  [C0402]
C191  value 1uF  [C0402]
C192  value 1uF  [C0402]
CN3  value 53047-0210  [CON_MOLEX_53047-0210]
L9  LQM18FN4R7M00D  [L0603]
R74  value 0R  [R0402]
R78  value 0R  [R0402]
R79  value 0R  [R0402]
U13  STM32MP157CAC3  [ICC_TFBGA361_12X12_STM32MP157CAC3_P050-065]  (part D of 5)

### Nets
GND: C7.1 C64.1 C72.1 C73.1 C89.1 C139.1 C143.1 C144.1 C145.1 C146.1 C147.1 C148.1 C149.1 C150.1 C152.1 C153.1 C155.1 C156.1 C158.1 C159.1 C161.1 C162.1 C163.1 C165.1 C191.1 C192.1 CN3.2 U13.1A3(VSS) U13.1A5(VSS) U13.1A7(VSS) U13.1B2(VSS) U13.1B4(VSS) U13.1B6(VSS) U13.1B8(VSS) U13.1C1(VSS) U13.1C3(VSS) U13.1C5(VSS) U13.1C7(VSS) U13.1C9(VSS) U13.1D2(VSS) U13.1D4(VSS) U13.1D6(VSS) U13.1D8(VSS) U13.1E1(VSS) U13.1E3(VSS) U13.1E5(VSS) U13.1E7(VSS) U13.1E9(VSS) U13.1F2(VSS) U13.1F4(VSS) U13.1F6(VSS) U13.1F8(VSS) U13.1G1(VSS_ANA) U13.1G3(VSS) U13.1G5(VSS) U13.1G7(VSS) U13.1G9(VSS) U13.1H2(VSSA) U13.1H4(VSS) U13.1H6(VSS) U13.1H8(VSS) U13.1J3(VSS) U13.1J5(VSS) U13.1J7(VSS) U13.A1(VSS) U13.A23(VSS) U13.AA5(VSS) U13.AA8(VSS) U13.AA12(VSS) U13.AA16(VSS_USBHS) U13.AA21(VSS) U13.AC1(VSS) U13.AC23(VSS) U13.C7(VSS) U13.C12(VSS) U13.C16(VSS_DSI) U13.C21(VSS) U13.D4(VSS) U13.F21(VSS) U13.H3(VSS) U13.K21(VSS) U13.P3(VSS) U13.P21(VSS) U13.V21(VSS) U13.W3(VSS)
VDD: C147.2 C152.2 C158.2 C159.2 C161.2 C191.2 R79.1 U13.1F3(VDD) U13.1G2(VDD_ANA) U13.1G4(VDD) U13.1H3(VDD) U13.1H5(VDD) U13.1J2(VDD_OTP) U13.1J4(VDD) U13.1J6(VDD) U13.B18(VDD_DSI)
VDD_CORE: C148.2 C150.2 C153.2 C155.2 C156.2 C162.2 C163.2 C192.2 U13.1A2(VDDCORE) U13.1A4(VDDCORE) U13.1A6(VDDCORE) U13.1B1(VDDCORE) U13.1B3(VDDCORE) U13.1B5(VDDCORE) U13.1C2(VDDCORE) U13.1C4(VDDCORE) U13.1C6(VDDCORE) U13.1D1(VDDCORE) U13.1D3(VDDCORE) U13.1D5(VDDCORE) U13.1D7(VDDCORE) U13.1E2(VDDCORE) U13.1E4(VDDCORE) U13.1E6(VDDCORE) U13.1F5(VDDCORE) U13.1F7(VDDCORE) U13.1G6(VDDCORE) U13.1H7(VDDCORE)
VDD_DDR: C143.2 C144.2 C145.2 C146.2 U13.1A8(VDDQ_DDR) U13.1B7(VDDQ_DDR) U13.1B9(VDDQ_DDR) U13.1C8(VDDQ_DDR) U13.1D9(VDDQ_DDR) U13.1E8(VDDQ_DDR) U13.1F9(VDDQ_DDR) U13.1G8(VDDQ_DDR) U13.1H9(VDDQ_DDR) U13.1J8(VDDQ_DDR)
VDD_USB: C139.2 U13.AA15(VDD3V3_USBHS) U13.AA17(VDD3V3_USBFS)
VDDA: R78.1
VDDA_1V8: C73.2 C149.2 U13.AB14(VDDA1V8_REG) U13.C14(VDDA1V8_DSI)
VREF+: C165.2 R74.2 U13.R4(VREF+)
NetC7_2: C7.2 CN3.1 U13.1F1(VBAT)
NetC64_2: C64.2 U13.C17(VDD1V2_DSI_PHY) U13.C18(VDD1V2_DSI_REG)
NetC72_2: C72.2 U13.AB15(VDDA1V1_REG)
NetC89_2: C89.2 L9.2 R74.1 R78.2 U13.1H1(VDDA)
NetL9_1: L9.1 R79.2

### Notes on the sheet
- (near CN3) backup battery connector
- to ARDUINO
- Title:
- Project:
- Size:
- Revision:
- Variant:
- A3
- -
- Date:
- Reference:
- Sheet:
- of

### Library data of the parts
C7 C139 C149 = MCD-00006: Capacitor,100nF,16V,X7R,10%,0402; Manufacturer_Part_Number: CC0402KRX7R7BB104; Manufacturer: YAGEO; Alternate_Manufacturer: MURATA; Alternate_Manufacturer_Part_Number: GCM155R71C104KA55D; Provided_By: SUBCO; Initial_Board_Reference: MB1274; Internal_Part_Number: MCD-00006; ComponentLink1Description: Datasheet; ECCN_US: n/a; ECCN_EU: n/a; Status: Released; Part_Type: Capacitor; Package: C0402; ComponentLink1URL: http://tunmcdsvn.tun.st.com/Component_Datasheet_Library/Trunk/Capacitors/Yageo_Multilayer_Capacitor_X7R_series_100pF_to_22uF
C64 C72 C73 C89 C143 C146-C148 C150 C152 C153 C155 C156 C158 C159 C161-C163 C165 C191 C192 = MCD-00095: Capacitor,1uF,6V3,X5R,10%,0402; Manufacturer_Part_Number: GRM155R61E105KA12; Manufacturer: MURATA; Alternate_Manufacturer_Part_Number: GRM155R60J105KE19; ECCN_US: EAR99; ECCN_EU: NEC; Provided_By: SUBCO; Initial_Board_Reference: MB1262; Internal_Part_Number: MCD-00095; Status: Released; Part_Type: Capacitor; Package: C0402; ComponentLink1Description: Datasheet; ComponentLink1URL: http://tunmcdsvn.tun.st.com/Component_Datasheet_Library/Trunk/Capacitors/Murata_Capacitor_GR_series; Alternate_Manufacturer: MURATA
C144 C145 = MCD-00198: Capacitor,1nF,16V,X7R,10%,0402; Manufacturer_Part_Number: CC0402KRX7R7BB102; Manufacturer: YAGEO; Provided_By: SUBCO; Internal_Part_Number: MCD-00198; Status: Released; Part_Type: Capacitor; Package: C0402; ComponentLink1Description: Datasheet; ComponentLink1URL: http://tunmcdsvn.tun.st.com/Component_Datasheet_Library/Trunk/Capacitors/Yageo_Multilayer_Capacitor_X7R_series_100pF_to_22uF
CN3 = MCD-00655: Header 2 circuits, 1.25mm Pitch ,  Vertical, with Friction Lock; Part_Type: Connector; Manufacturer: MOLEX; Provided_By: SUBCO; Initial_Board_Reference: MB1272; Internal_Part_Number: MCD-00655; Status: Footprint available; Manufacturer_Part_Number: 53047-0210; ComponentLink1Description: Datasheet; ComponentLink1URL: http://tunmcdsvn.tun.st.com/Component_Datasheet_Library/Trunk/Connectors/Molex_SD530470210; ECCN_US: n/a; ECCN_EU: n/a
L9 = MCD-01134: IND 4.7µH 20% 80mA 600mhom 0603; Part_Type: Inductor; Manufacturer: MURATA; Provided_By: SUBCO; Initial_Board_Reference: MB1272; Internal_Part_Number: MCD-01134; Value: LQM18FN4R7M00D; Status: Footprint available; Manufacturer_Part_Number: LQM18FN4R7M00D; Package: 0603; ComponentLink1Description: Datasheet; ComponentLink1URL: http://tunmcdsvn.tun.st.com/Component_Datasheet_Library/Trunk/Inductors/Murata_inductor_LQM18FN4R7M00D; ECCN_US: n/a; ECCN_EU: n/a
R74 R78 = MCD-00052: Resistor,0R,0402,5%,1/16W; Manufacturer_Part_Number: RC0402JR-070RL; Manufacturer: YAGEO; Provided_By: SUBCO; Initial_Board_Reference: MB1274; Internal_Part_Number: MCD-00052; Status: Released; Part_Type: Resistor; ComponentLink1Description: Datasheet; ECCN_US: n/a; ECCN_EU: n/a; ComponentLink1URL: http://tunmcdsvn.tun.st.com/Component_Datasheet_Library/Trunk/Resistors/Yageo_Resistor_RC0402-series; Package: R0402
R79 = MCD-00052: Resistor,0R,0402,5%,1/16W; Manufacturer_Part_Number: RC0402JR-070RL; Manufacturer: YAGEO; Provided_By: SUBCO; Initial_Board_Reference: MB1274; Fitted: NO; Internal_Part_Number: MCD-00052; Status: Released; Part_Type: Resistor; ComponentLink1Description: Datasheet; ECCN_US: n/a; ECCN_EU: n/a; ComponentLink1URL: http://tunmcdsvn.tun.st.com/Component_Datasheet_Library/Trunk/Resistors/Yageo_Resistor_RC0402-series; Package: R0402
U13 = MCD-00677: MPU TFBGA12x12 secure boot+crypto; Part_Type: IC; Manufacturer: STMICROELECTRONICS; BMS_Part_Number: 9175503; Provided_By: SUBCO with ST control; Internal_Part_Number: MCD-00677; Value: STM32MP157CAC3; Status: Footprint available; Manufacturer_Part_Number: STM32MP157CAC3; ComponentLink1Description: Datasheet; ComponentLink1URL: http://tunmcdsvn.tun.st.com/Component_Datasheet_Library/Trunk/IC/STM_MPU_12x12_POA_DM00342580_POA12x12